# Altium schematic sheet Client_Sheet3.SchDoc: Project Vega - Client Node
size A4; DrawnBy: Jithendra H S; Revision: 1; SheetNumber: 7; SheetTotal: 8
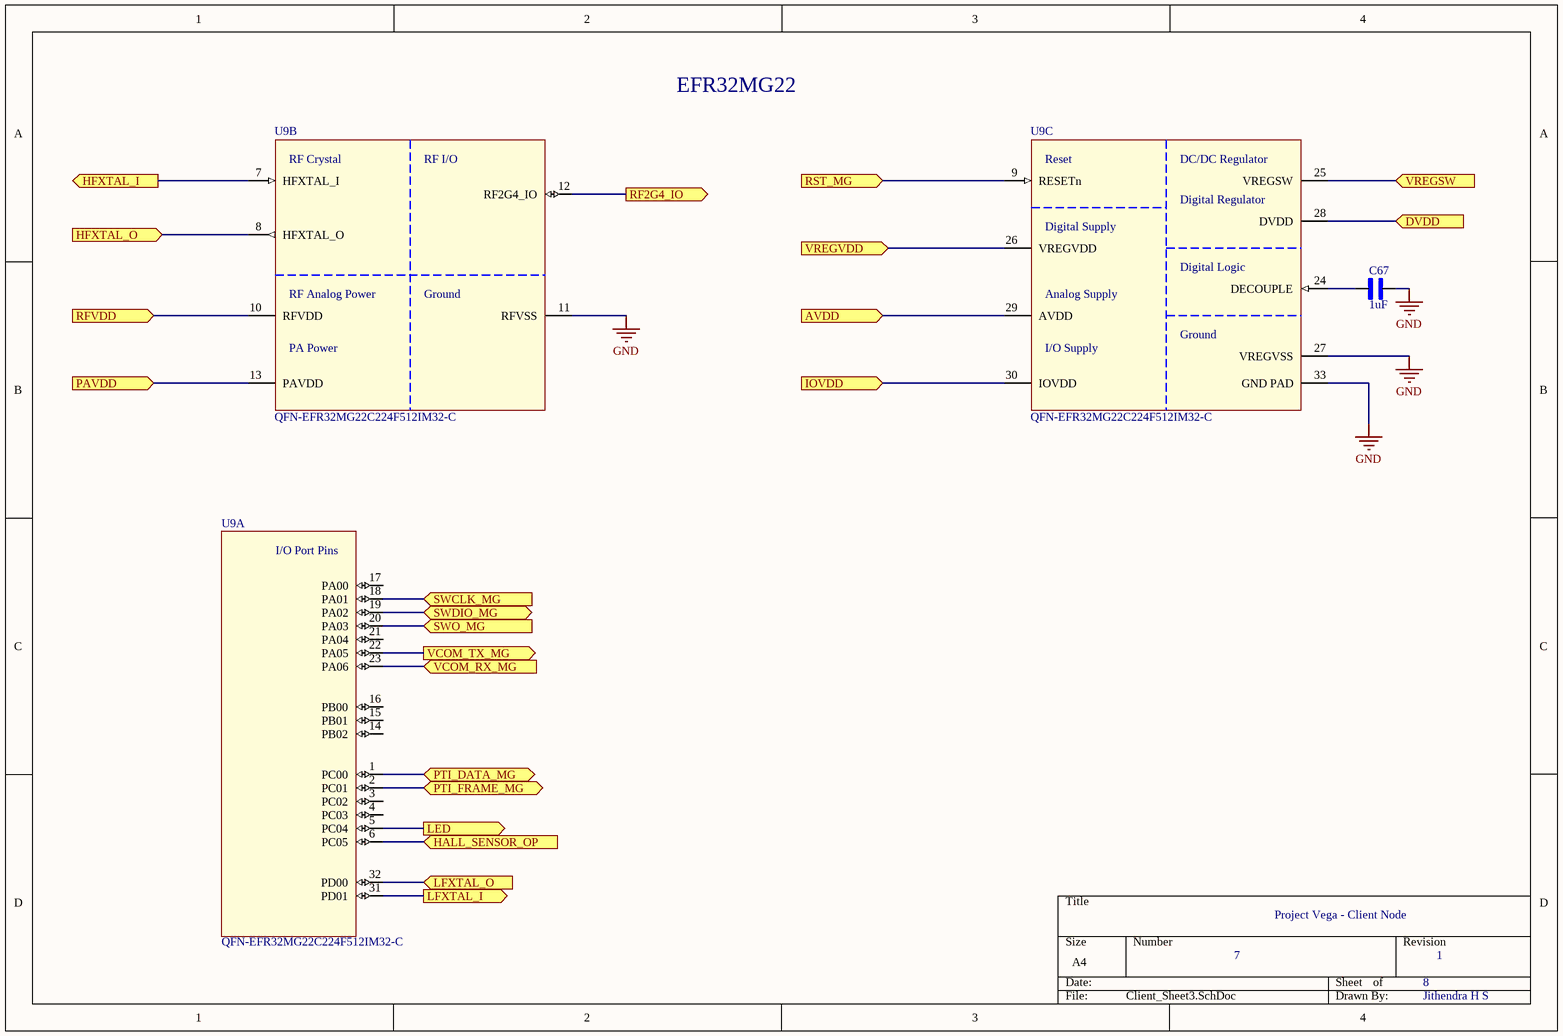
[diagram p0: Client_Sheet3.SchDoc]

## Parts
C67  1uF  [CAPC1608X90]
U9  QFN-EFR32MG22C224F512IM32-C  [QFN32-EFR32xG2xIM32-BR]  (parts A,B,C of 3)

## Ports
AVDD (in, see Client_Sheet2[3D]), DVDD (in, see Client_Sheet2[3B]), HALL_SENSOR_OP (in, see Client_Sheet2[1B], Client_Sheet2[4A]), HFXTAL_I (out, see Client_Sheet2[3C]), HFXTAL_O (in, see Client_Sheet2[4C]), IOVDD (in, see Client_Sheet2[3D]), LED (out, see Client_Sheet2[4C]), LFXTAL_I (out, see Client_Sheet2[3C]), LFXTAL_O (in, see Client_Sheet2[4C]), PAVDD (in), PTI_DATA_MG (bidir, see Client_Sheet2[2A]), PTI_FRAME_MG (bidir, see Client_Sheet2[2A]), RF2G4_IO (out, see Client_Sheet2[1C]), RFVDD (in), RST_MG (in, see Client_Sheet2[2A]), SWCLK_MG (in, see Client_Sheet2[2A]), SWDIO_MG (bidir, see Client_Sheet2[2A]), SWO_MG (in, see Client_Sheet2[2A]), VCOM_RX_MG (in, see Client_Sheet2[2A]), VCOM_TX_MG (out, see Client_Sheet2[2A]), VREGSW (in, see Client_Sheet2[3C]), VREGVDD (in, see Client_Sheet2[3C])

## Nets
GND: C67.2 U9.11(RFVSS) U9.27(VREGVSS) U9.33(GND_PAD)
AVDD: U9.29(AVDD) ; port AVDD
DVDD: U9.28(DVDD) ; port DVDD
HALL_SENSOR_OP: U9.6(PC05) ; port HALL_SENSOR_OP
HFXTAL_I: U9.7(HFXTAL_I) ; port HFXTAL_I
HFXTAL_O: U9.8(HFXTAL_O) ; port HFXTAL_O
IOVDD: U9.30(IOVDD) ; port IOVDD
LED: U9.5(PC04) ; port LED
LFXTAL_I: U9.31(PD01) ; port LFXTAL_I
LFXTAL_O: U9.32(PD00) ; port LFXTAL_O
PAVDD: U9.13(PAVDD) ; port PAVDD
PTI_DATA_MG: U9.1(PC00) ; port PTI_DATA_MG
PTI_FRAME_MG: U9.2(PC01) ; port PTI_FRAME_MG
RF2G4_IO: U9.12(RF2G4_IO) ; port RF2G4_IO
RFVDD: U9.10(RFVDD) ; port RFVDD
RST_MG: U9.9(RESETn) ; port RST_MG
SWCLK_MG: U9.18(PA01) ; port SWCLK_MG
SWDIO_MG: U9.19(PA02) ; port SWDIO_MG
SWO_MG: U9.20(PA03) ; port SWO_MG
VCOM_RX_MG: U9.23(PA06) ; port VCOM_RX_MG
VCOM_TX_MG: U9.22(PA05) ; port VCOM_TX_MG
VREGSW: U9.25(VREGSW) ; port VREGSW
VREGVDD: U9.26(VREGVDD) ; port VREGVDD
NetC67_1: C67.1 U9.24(DECOUPLE)

Not connected (* = marked no-connect by the designer): U9 3(PC02) 4(PC03) 14(PB02) 15(PB01) 16(PB00) 17(PA00) 21(PA04)

## Notes on the sheet
- EFR32MG22
- (in symbol EFR32MG22C224F512IM32-C, part A) I/O Port Pins
- (in symbol EFR32MG22C224F512IM32-C, part B) RF Crystal; RF I/O; RF Analog Power; Ground; PA Power
- (in symbol EFR32MG22C224F512IM32-C, part C) Reset; DC/DC Regulator; Digital Regulator; Digital Supply; Digital Logic; Analog Supply; Ground; I/O Supply

## Library data of the parts
C67 = CC0603KRX7R9BB104: 0.1 ÂµF Â±10% 50V Ceramic Capacitor X7R 0603 (1608 Metric); MF: Yageo; SnapEDA_Link: https://www.snapeda.com/parts/CC0603KRX7R9BB104/Yageo/view-part/?ref=snap; Package: 0603 Yageo; Value: *; MP: CC0603KRX7R9BB104; Check_prices: https://www.snapeda.com/parts/CC0603KRX7R9BB104/Yageo/view-part/?ref=eda; Supplier 1: Digikey; Supplier Part Number 1: 445-12472-1-ND
U9 = EFR32MG22C224F512IM32-C: IC RF TxRx + MCU WiFi Bluetooth v5.2, Zigbee® 2.4GHz 32-VFQFN Exposed Pad